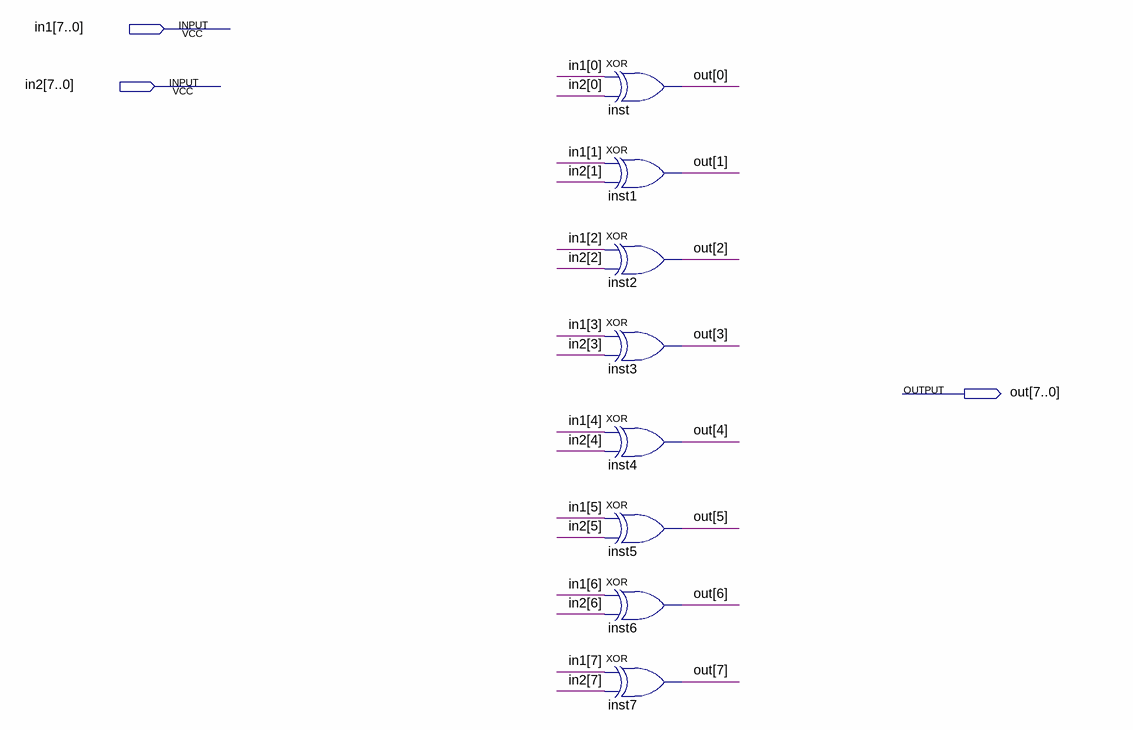
[diagram p0: schematic sheet]
// Quartus schematic XORByte.bdf as structural Verilog: 8 symbols, 3 pins
module XORByte (
  input  [7:0] in1,
  input  [7:0] in2,
  output [7:0] out
);

  xor inst (out[0], in1[0], in2[0]);
  xor inst1 (out[1], in1[1], in2[1]);
  xor inst2 (out[2], in1[2], in2[2]);
  xor inst3 (out[3], in1[3], in2[3]);
  xor inst4 (out[4], in1[4], in2[4]);
  xor inst5 (out[5], in1[5], in2[5]);
  xor inst6 (out[6], in1[6], in2[6]);
  xor inst7 (out[7], in1[7], in2[7]);
endmodule
